# EAGLE schematic copter (EAGLE 7.5.0)

## Sheet 1 of 2: main
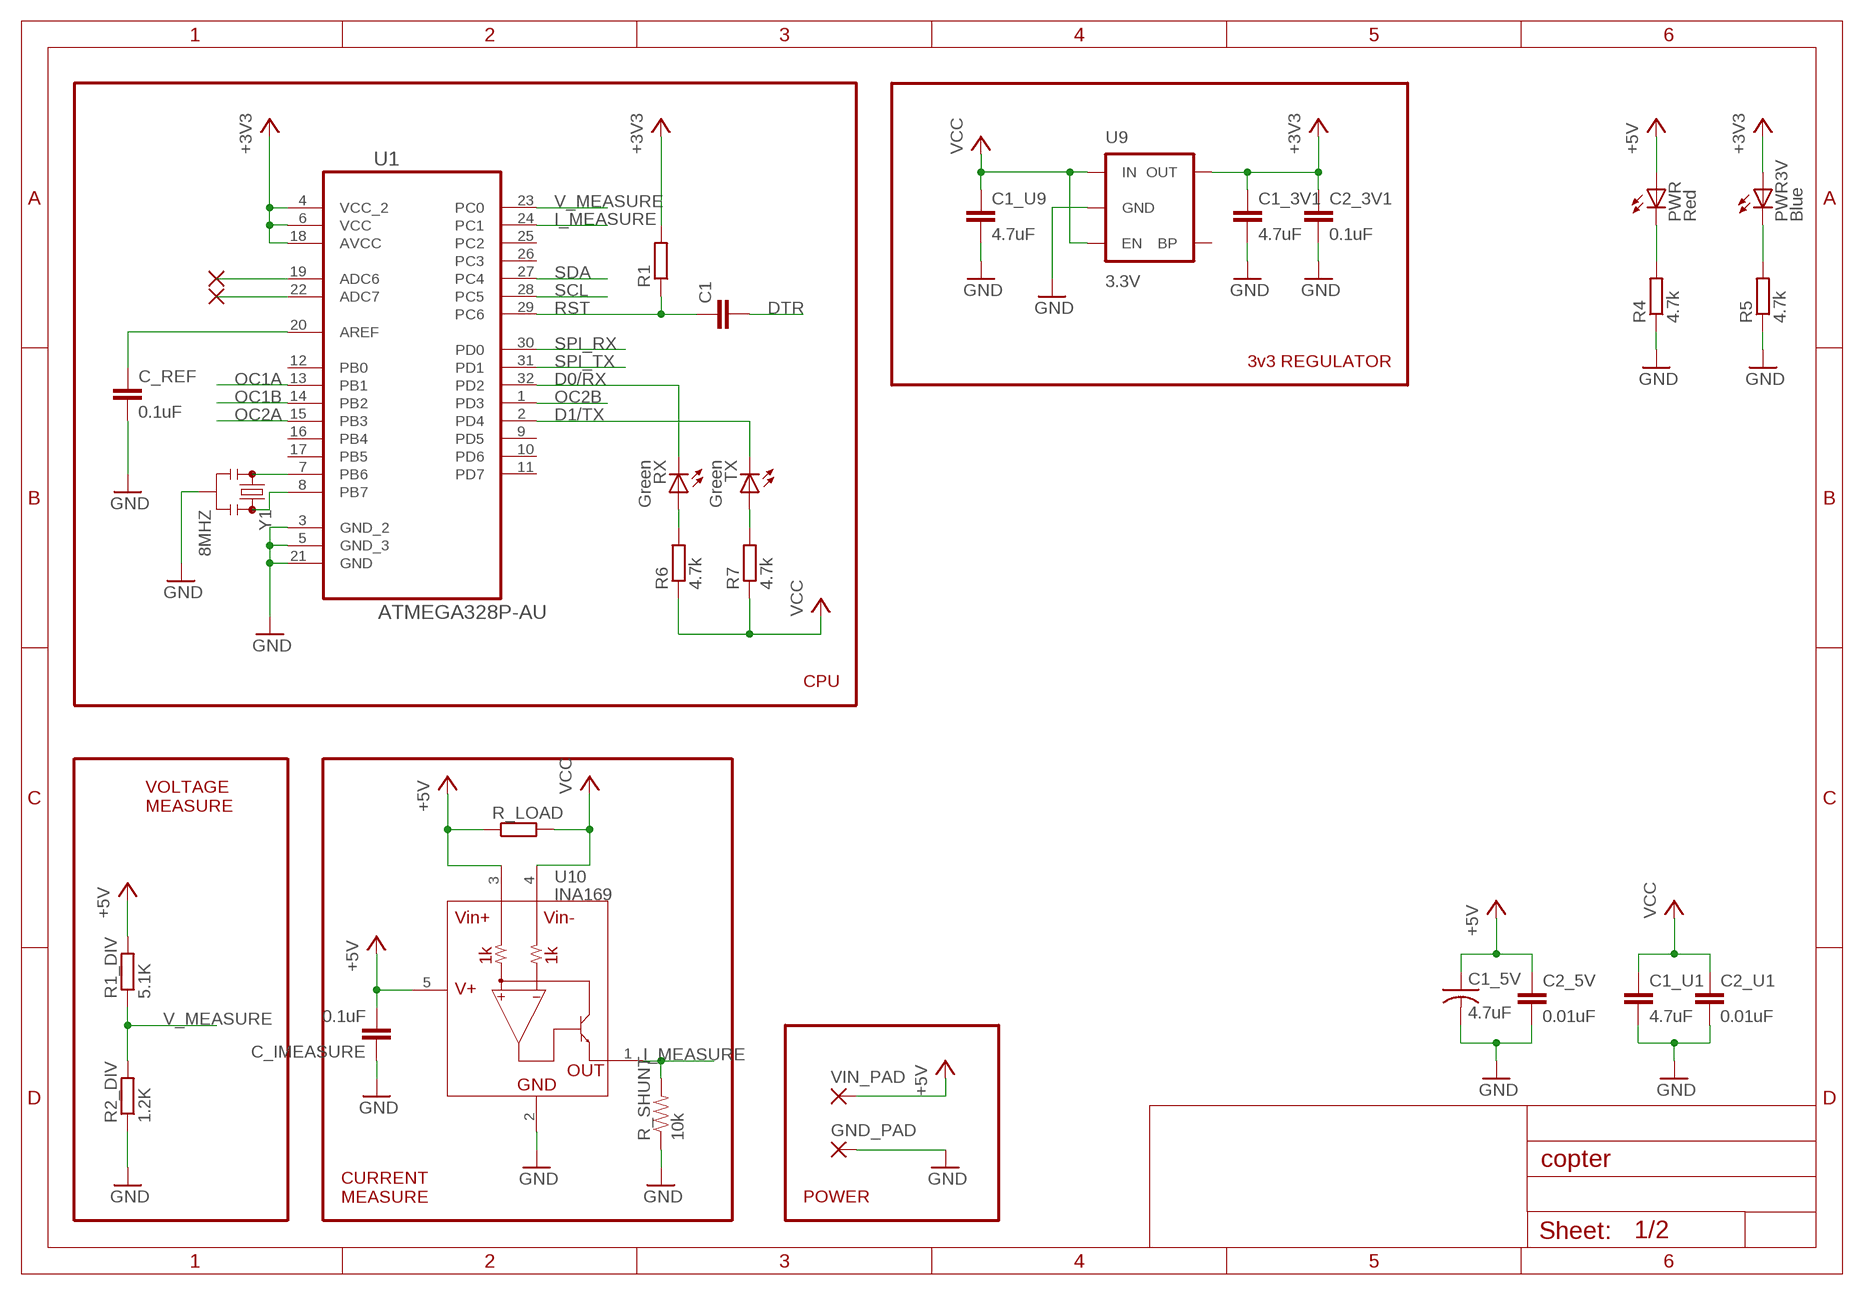
[diagram p0: schematic, sheet 1]

### Parts
C1  C-EUC0402  [C0402]
C1_3V1  4.7uF  CAP0402-CAP  [0402-CAP]
C1_5V  4.7uF  C-USC1210K  [C1210K]
C1_U1  4.7uF  C-EUC1206  [C1206]
C1_U9  4.7uF  CAP0402-CAP  [0402-CAP]
C2_3V1  0.1uF  CAP0402-CAP  [0402-CAP]
C2_5V  0.01uF  C-EUC0402  [C0402]
C2_U1  0.01uF  C-EUC0402  [C0402]
C_IMEASURE  0.1uF  CAP0603-CAP  [0603-CAP]
C_REF  0.1uF  C-EUC0402  [C0402]
GND_PAD  1,6/0,8  [1,6/0,8]
PWR  Red  LED0603  [LED-0603]
PWR3V  Blue  LED0603  [LED-0603]
R1  R-EU_R0402  [R0402]
R1_DIV  5.1K  R-EU_R0402  [R0402]
R2_DIV  1.2K  R-EU_R0402  [R0402]
R4  4.7k  R-EU_R0402  [R0402]
R5  4.7k  R-EU_R0402  [R0402]
R6  4.7k  R-EU_R0402  [R0402]
R7  4.7k  R-EU_R0402  [R0402]
R_LOAD  R-EU_0309/10  [0309/10]
R_SHUNT  10k  RESISTOR0603  [0603-RES]
RX  Green  LED0603  [LED-0603]
TX  Green  LED0603  [LED-0603]
U1  ATMEGA328P-AU  [QFP80P900X900X120-32N]
U9  3.3V  V_REG_LDOSMD  [SOT23-5]
U10  INA169  [SOT23-5]
VIN_PAD  1,6/0,8  [1,6/0,8]
Y1  8MHZ  RESONATOR8MHZ  [RESONATOR-SMD]

### Nets
+3V3: C1_3V1.1 C2_3V1.1 PWR3V.A R1.2 U1.4(VCC_2) U1.6(VCC) U1.18(AVCC) U9.5(OUT) ; also sheet 2
+5V [motor]: C1_5V.1 C2_5V.1 C_IMEASURE.2 PWR.A R1_DIV.2 R_LOAD.1 U10.3(VIN+) U10.5(V+) VIN_PAD.1(P) ; also sheet 2
D0/RX: RX.C U1.32(PD2) ; also sheet 2
D1/TX: TX.C U1.2(PD4) ; also sheet 2
DTR: C1.2 ; also sheet 2
GND: C1_3V1.2 C1_5V.2 C1_U1.2 C1_U9.2 C2_3V1.2 C2_5V.2 C2_U1.2 C_IMEASURE.1 C_REF.2 GND_PAD.1(P) R2_DIV.1 R4.1 R5.1 R_SHUNT.1 U1.3(GND_2) U1.5(GND_3) U1.21(GND) U9.2(GND) U10.2(GND) Y1.2 ; also sheet 2
I_MEASURE: R_SHUNT.2 U1.24(PC1) U10.1(OUT)
N$3: R7.2 TX.A
N$5: R6.2 RX.A
N$6: PWR.C R4.2
N$8: PWR3V.C R5.2
N$17: C_REF.1 U1.20(AREF)
N$18: U1.19(ADC6)
N$19: U1.22(ADC7)
N$20: U1.7(PB6) Y1.1
N$21: U1.8(PB7) Y1.3
OC1A: U1.13(PB1) ; also sheet 2
OC1B: U1.14(PB2) ; also sheet 2
OC2A: U1.15(PB3) ; also sheet 2
OC2B: U1.1(PD3) ; also sheet 2
RST: C1.1 R1.1 U1.29(PC6)
SCL: U1.28(PC5) ; also sheet 2
SDA: U1.27(PC4) ; also sheet 2
SPI_RX: U1.30(PD0) ; also sheet 2
SPI_TX: U1.31(PD1) ; also sheet 2
V_MEASURE: R1_DIV.1 R2_DIV.2 U1.23(PC0)
VCC: C1_U1.1 C1_U9.1 C2_U1.1 R6.1 R7.1 R_LOAD.2 U9.1(IN) U9.3(EN) U10.4(VIN-) ; also sheet 2
Unconnected: U1.9(PD5) U1.10(PD6) U1.11(PD7) U1.12(PB0) U1.16(PB4) U1.17(PB5) U1.25(PC2) U1.26(PC3) U9.4(BP)

### Notes on the sheet
- 3v3 REGULATOR
- CPU
- VOLTAGE
  MEASURE
- CURRENT
  MEASURE
- POWER

## Sheet 2 of 2: 9dof
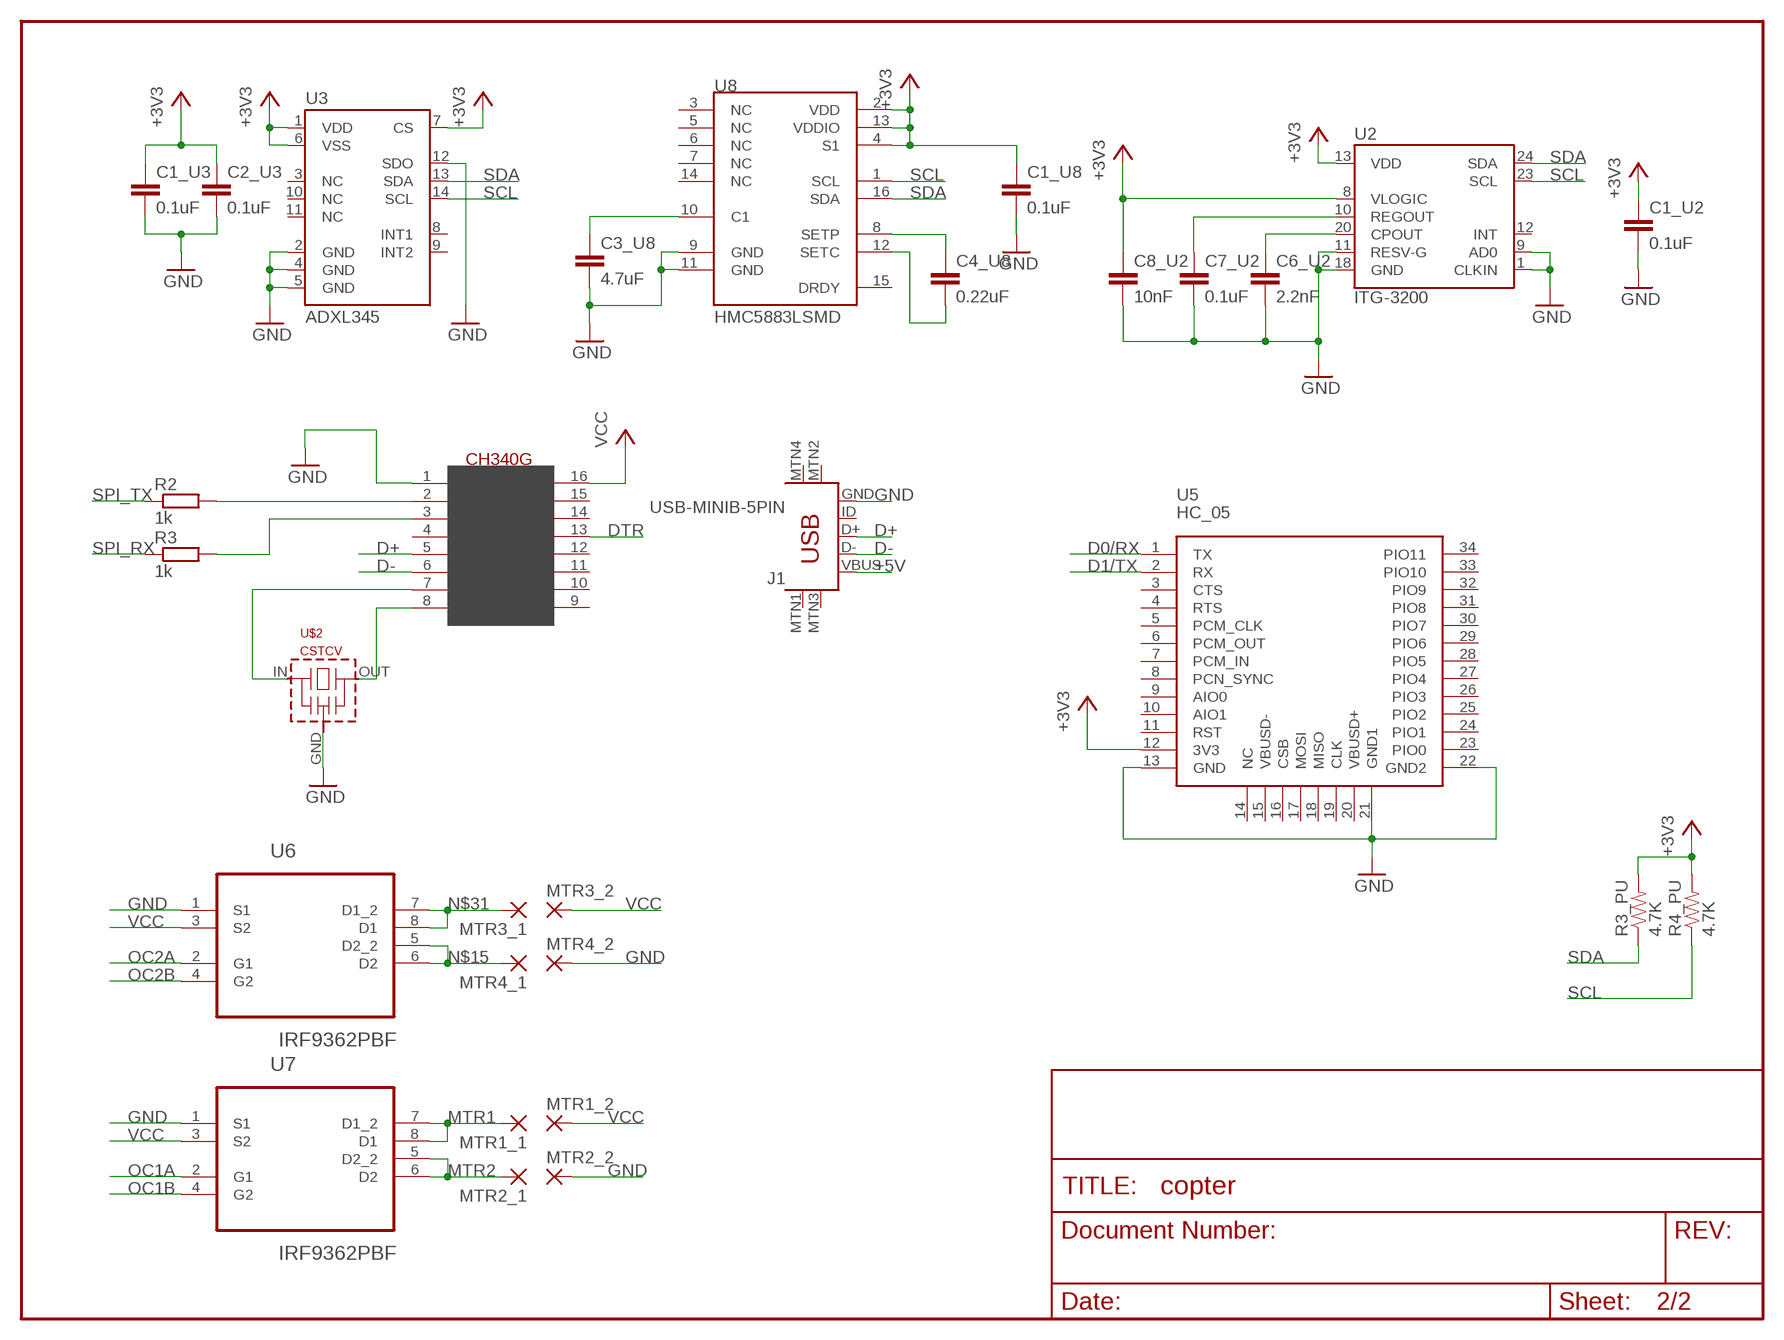
[diagram p1: schematic, sheet 2]

### Parts
C1_U2  0.1uF  CAP0402-CAP  [0402-CAP]
C1_U3  0.1uF  CAP0402-CAP  [0402-CAP]
C1_U8  0.1uF  CAP0402-CAP  [0402-CAP]
C2_U3  0.1uF  CAP0402-CAP  [0402-CAP]
C3_U8  4.7uF  CAP0402-CAP  [0402-CAP]
C4_U8  0.22uF  CAP0402-CAP  [0402-CAP]
C6_U2  2.2nF  CAP0402-CAP  [0402-CAP]
C7_U2  0.1uF  CAP0402-CAP  [0402-CAP]
C8_U2  10nF  CAP0402-CAP  [0402-CAP]
J1  USB-MINIB-5PIN  [USB-MINIB]
MTR1_1  1,6/0,8  [1,6/0,8]
MTR1_2  1,6/0,8  [1,6/0,8]
MTR2_1  1,6/0,8  [1,6/0,8]
MTR2_2  1,6/0,8  [1,6/0,8]
MTR3_1  1,6/0,8  [1,6/0,8]
MTR3_2  1,6/0,8  [1,6/0,8]
MTR4_1  1,6/0,8  [1,6/0,8]
MTR4_2  1,6/0,8  [1,6/0,8]
R2  1k  R-EU_R0402  [R0402]
R3  1k  R-EU_R0402  [R0402]
R3_PU  4.7K  RESISTOR0402-RES  [0402-RES]
R4_PU  4.7K  RESISTOR0402-RES  [0402-RES]
U2  ITG-3200  [QFN-24]
U3  ADXL345  [LGA14]
U5  HC_05  [BLUETOOTH_SMD]
U6  IRF9362PBF  [SOIC127P600X175-8N]
U7  IRF9362PBF  [SOIC127P600X175-8N]
U8  HMC5883LSMD  [16LPCC]
U$1  CH340G  [SOIC16]
U$2  CSTCV  [CSTCV]

### Nets
+3V3: C1_U2.1 C1_U3.1 C1_U8.1 C2_U3.1 C8_U2.1 R3_PU.2 R4_PU.2 U2.8(VLOGIC) U2.13(VDD) U3.1(VDD) U3.6(VSS) U3.7(CS) U5.12(3V3) U8.2(VDD) U8.4(S1) U8.13(VDDIO) ; also sheet 1
+5V [motor]: J1.VBUS ; also sheet 1
D0/RX: U5.1(TX) ; also sheet 1
D1/TX: U5.2(RX) ; also sheet 1
D+: J1.D+ U$1.5(D+)
D-: J1.D- U$1.6(D-)
DTR: U$1.13(DTR) ; also sheet 1
GND: C1_U2.2 C1_U3.2 C1_U8.2 C2_U3.2 C3_U8.2 C6_U2.2 C7_U2.2 C8_U2.2 J1.GND MTR2_2.1(P) MTR4_2.1(P) U2.1(CLKIN) U2.9(AD0) U2.11(RESV-G) U2.18(GND) U3.2(GND) U3.4(GND) U3.5(GND) U3.12(SDO) U5.13(GND) U5.21(GND1) U5.22(GND2) U6.1(S1) U7.1(S1) U8.9(GND) U8.11(GND) U$1.1(GND) U$2.GND ; also sheet 1
MTR1: MTR1_1.1(P) U7.7(D1_2) U7.8(D1)
MTR2: MTR2_1.1(P) U7.5(D2_2) U7.6(D2)
N$1: R2.2 U$1.2(TX)
N$2: C6_U2.1 U2.20(CPOUT)
N$4: R3.2 U$1.3(RX)
N$7: C7_U2.1 U2.10(REGOUT)
N$9: U$1.8(XO) U$2.OUT
N$10: C3_U8.1 U8.10(C1)
N$11: C4_U8.1 U8.8(SETP)
N$14: C4_U8.2 U8.12(SETC)
N$15: MTR4_1.1(P) U6.5(D2_2) U6.6(D2)
N$16: U$1.7(XI) U$2.IN
N$31: MTR3_1.1(P) U6.7(D1_2) U6.8(D1)
OC1A: U7.2(G1) ; also sheet 1
OC1B: U7.4(G2) ; also sheet 1
OC2A: U6.2(G1) ; also sheet 1
OC2B: U6.4(G2) ; also sheet 1
SCL: R4_PU.1 U2.23(SCL) U3.14(SCL) U8.1(SCL) ; also sheet 1
SDA: R3_PU.1 U2.24(SDA) U3.13(SDA) U8.16(SDA) ; also sheet 1
SPI_RX: R3.1 ; also sheet 1
SPI_TX: R2.1 ; also sheet 1
VCC: MTR1_2.1(P) MTR3_2.1(P) U6.3(S2) U7.3(S2) U$1.16(VCC) ; also sheet 1
Unconnected: J1.ID J1.MTN1(MTN2) J1.MTN2(MTN3) J1.MTN3(MTN1) J1.MTN4 U2.12(INT) U3.3(NC) U3.8(INT1) U3.9(INT2) U3.10(NC) U3.11(NC) U5.3(CTS) U5.4(RTS) U5.5(PCM_CLK) U5.6(PCM_OUT) U5.7(PCM_IN) U5.8(PCN_SYNC) U5.9(AIO0) U5.10(AIO1) U5.11(RST) U5.14(NC) U5.15(VBUSD-) U5.16(CSB) U5.17(MOSI) U5.18(MISO) U5.19(CLK) U5.20(VBUSD+) U5.23(PIO0) U5.24(PIO1) U5.25(PIO2) U5.26(PIO3) U5.27(PIO4) U5.28(PIO5) U5.29(PIO6) U5.30(PIO7) U5.31(PIO8) U5.32(PIO9) U5.33(PIO10) U5.34(PIO11) U8.3(NC) U8.5(NC) U8.6(NC) U8.7(NC) U8.14(NC) U8.15(DRDY) U$1.4(V3) U$1.9(CTS) U$1.10(DSR) U$1.11(RI) U$1.12(DCD) U$1.14(RTS) U$1.15(RS232)

## Library data of the parts
C1 = rcl:C-EU: CAPACITOR, European symbol
C1_3V1 C1_U2 C1_U3 C1_U8 C1_U9 C2_3V1 C2_U3 C3_U8 C4_U8 C6_U2 C7_U2 C8_U2 = SparkFun:CAP: Capacitor Standard 0603 ceramic capacitor, and 0.1" leaded capacitor.
C1_5V = rcl:C-US: CAPACITOR, American symbol
C1_U1 C2_5V C2_U1 C_REF = resistor:C-EU: CAPACITOR, European symbol
C_IMEASURE = SparkFun-Passives:CAP: Capacitor Standard 0603 ceramic capacitor, and 0.1" leaded capacitor.
GND_PAD MTR1_1 MTR1_2 MTR2_1 MTR2_2 MTR3_1 MTR3_2 MTR4_1 MTR4_2 VIN_PAD = wirepad:1,6/0,8: THROUGH-HOLE PAD
J1 = SparkFun-Connectors:USB-MINIB: Mini-USB "B" connector with 5th pin broken out. Created new symbol breaking out 5th "ID" pin in mini/micro USB connector spec. See: http://en.wikipedia.org/wiki/Mini_usb#Cables. Uses same footprint as 4-pin symbol. Also added pins to connect to mounting / shield pads if required (probably not generally needed as signals aren't shielded once they leave the connector).; PROD_ID: CONN-08193
PWR PWR3V RX TX = SparkFun:LED: LEDs Standard schematic elements and footprints for 5mm, 3mm, 1206, and 0603 sized LEDs. 5mm - Spark Fun Electronics SKU : COM-00529 (and others)
R1 R4-R7 = rcl:R-EU_: RESISTOR, European symbol
R1_DIV R2 R2_DIV R3 = resistor:R-EU_: RESISTOR, European symbol
R3_PU R4_PU = SparkFun:RESISTOR: Resistor Basic schematic elements and footprints for 0603, 1206, and PTH resistors.
R_LOAD = resistor:R-EU_: RESISTOR, European symbol; SIZE: 1206; TOL: 1%
R_SHUNT = SparkFun-Resistors:RESISTOR: Resistor Basic schematic elements and footprints for 0603, 1206, and PTH resistors.; TOL: 1%
U1 = atmel:ATMEGA328P-AU: 8-bit Microcontroller with In-System Programmable Flash; MPN: ATMEGA328P-AU; OC_FARNELL: 1715486; OC_NEWARK: 14R4631; PACKAGE: TQFP-32; SUPPLIER: Atmel
U2 = SparkFun:ITG-3200: ITG-3200 3-axis gyro, digital output, qfn24 package
U3 = SparkFun:ADXL345
U5 = HC-05:HC_05: HC-05 Bluetooth Module
U6 U7 = International_Rectifier_By_element14_Batch_1:IRF9362PBF: HEXFET Power MOSFET; MPN: IRF9362PBF; OC_FARNELL: 1857301; OC_NEWARK: 79R7563; PACKAGE: SOIC-8; SUPPLIER: INTERNATIONAL RECTIFIER
U8 = SparkFun:HMC5883L: 3 Axis Digital Compass IC
U9 = SparkFun:V_REG_LDO: Voltage Regulator LDO Standard 150mA LDO voltage regulator in SOT-23 layout. Micrel part MIC5205. BP (by-pass) pin is used to lower output noise with 470pF cap.
U10 = SparkFun-AnalogIC:INA169
U$1 = usb-serial:CH340G
U$2 = murata-cstcc-cstce-cstcr-cstcv-resonators:CSTCV: Murata CSTCV Resonator - 3,7 x 3,1 mm
Y1 = SparkFun-FreqCtrl:RESONATOR: Resonator Small SMD resonator. Used, eg, on the Arduino Pro/ Pro Mini boards. 8MHz- XTAL-08895 16MHz- XTAL-08900; PROD_ID: XTAL-08895

## Net classes
0 default: clearance 0.205 mm
1 motor: width 0.406 mm, clearance 0.203 mm